# Altium project Version 2.PrjPcb
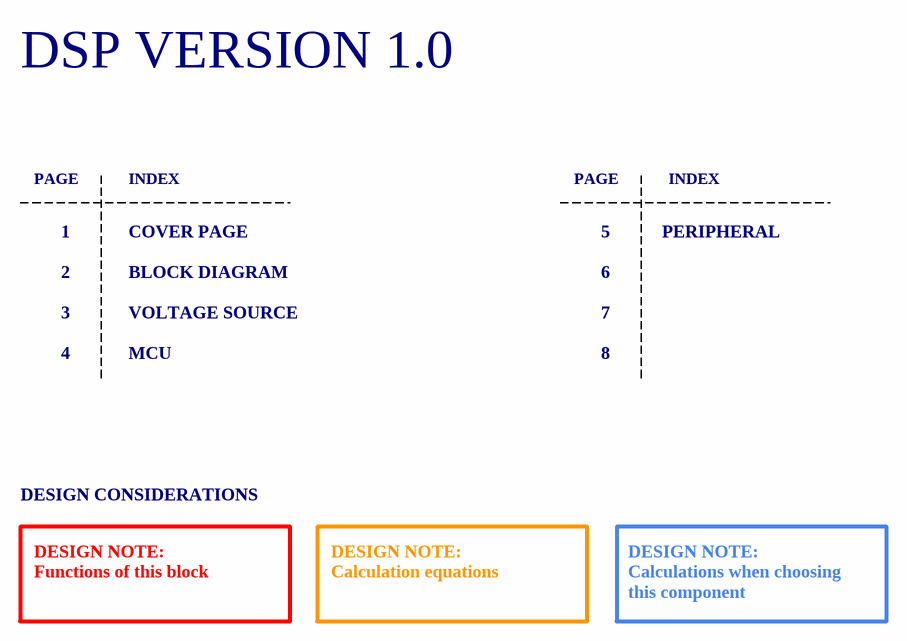
[diagram p0: Cover Page.SchDoc]
5 sheets, 113 parts. Net scope: global (net labels, ports and power ports of the same name join across sheets).
Sheets:
  Cover Page.SchDoc
  Block Diagram.SchDoc
  Voltage Source.SchDoc
  MCU.SchDoc
  PERIPHERAL.SchDoc

## Sheet Cover Page.SchDoc: Cover Page
size A4; Author: DODANHLUONG; Revision: 1.0; SheetNumber: 1; SheetTotal: 6; ProjectTitle: DSP_VERSION_1.0

### Notes on the sheet
- DSP VERSION 1.0
- PAGE
- INDEX
- 1
- 2
- COVER PAGE
- BLOCK DIAGRAM
- 5
- 6
- PERIPHERAL
- 3
- 4
- VOLTAGE SOURCE
- MCU
- 7
- 8
- DESIGN CONSIDERATIONS
- DESIGN NOTE:
  Functions of this block
- DESIGN NOTE:
  Calculation equations
- DESIGN NOTE:
  Calculations when choosing this component
- Author:
- Title:
- Size:
- A4
- Project:
- Approved:
- Revision:
- Modified Date:
- CONFIDENTIAL
- Date:
- SW Version:

## Sheet Block Diagram.SchDoc: Block Diagram
size A4; Author: DODANHLUONG; Revision: 1.0; SheetNumber: 2; SheetTotal: 6; ProjectTitle: DSP_VERSION_1.0

### Notes on the sheet
- Author:
- Title:
- Size:
- A4
- Project:
- Approved:
- Revision:
- Modified Date:
- CONFIDENTIAL
- Date:
- SW Version:

## Sheet Voltage Source.SchDoc: Voltage Source
size A4; Author: DODANHLUONG; Revision: 1.0; SheetNumber: 6; SheetTotal: 5; ProjectTitle: DSP_VERSION_1.0
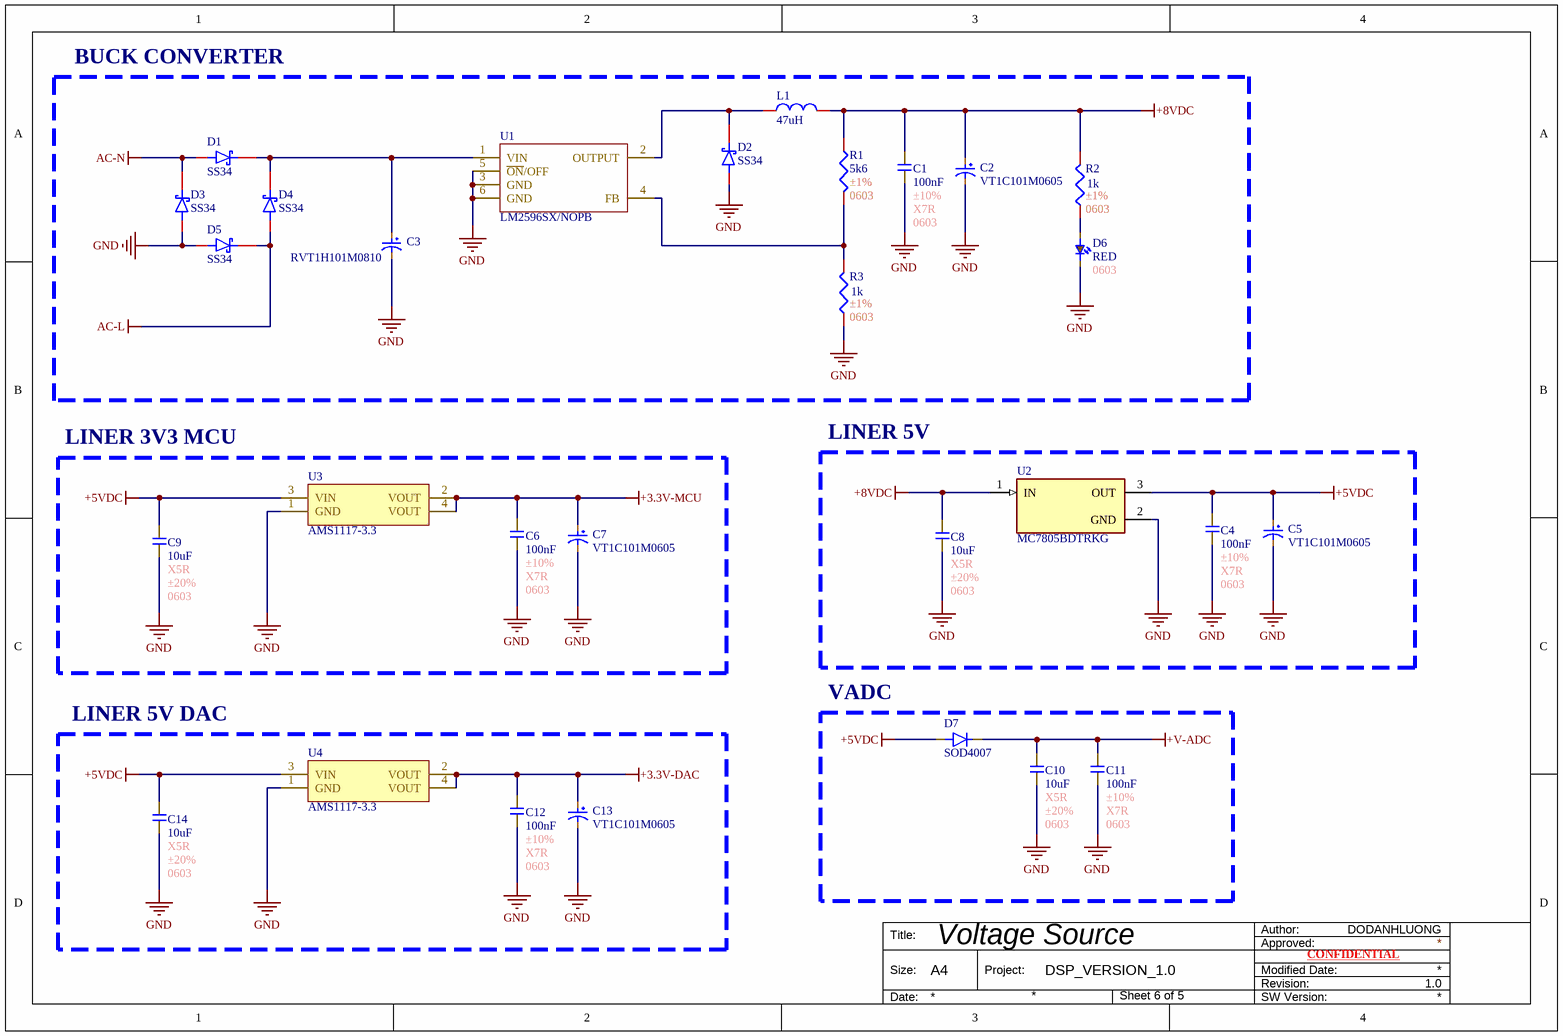
[diagram p1: Voltage Source.SchDoc]

### Parts
C1  100nF  Tolerance: ±10%  Temperature Coefficient: X7R  Package: 0603  [C0603]
C2  VT1C101M0605  [C_100uF_16V_Aluminum]
C3  RVT1H101M0810  [C_100uF_Aluminum]
C4  100nF  Tolerance: ±10%  Temperature Coefficient: X7R  Package: 0603  [C0603]
C5  VT1C101M0605  [C_100uF_16V_Aluminum]
C6  100nF  Tolerance: ±10%  Temperature Coefficient: X7R  Package: 0603  [C0603]
C7  VT1C101M0605  [C_100uF_16V_Aluminum]
C8  10uF  Temperature Coefficient: X5R  Tolerance: ±20%  Package: 0603  [C0603]
C9  10uF  Temperature Coefficient: X5R  Tolerance: ±20%  Package: 0603  [C0603]
C10  10uF  Temperature Coefficient: X5R  Tolerance: ±20%  Package: 0603  [C0603]
C11  100nF  Tolerance: ±10%  Temperature Coefficient: X7R  Package: 0603  [C0603]
C12  100nF  Tolerance: ±10%  Temperature Coefficient: X7R  Package: 0603  [C0603]
C13  VT1C101M0605  [C_100uF_16V_Aluminum]
C14  10uF  Temperature Coefficient: X5R  Tolerance: ±20%  Package: 0603  [C0603]
D1  SS34  [SS34]
D2  SS34  [SS34]
D3  SS34  [SS34]
D4  SS34  [SS34]
D5  SS34  [SS34]
D6  RED  Package: 0603  [LED0603]
D7  SOD4007  [SOD4007]
L1  47uH  [CD43]
R1  5k6  Tolerance: ±1%  Package: 0603  [R0603]
R2  1k  Tolerance: ±1%  Package: 0603  [R0603]
R3  1k  Tolerance: ±1%  Package: 0603  [R0603]
U1  LM2596SX/NOPB  [LM2596SX-5.0/NOPB]
U2  MC7805BDTRKG  [7805]
U3  AMS1117-3.3  [AMS1117-3.3]
U4  AMS1117-3.3  [AMS1117-3.3]

### Blocks framed on the sheet
BUCK CONVERTER: C1-C3 D1-D6 L1 R1-R3 U1
LINER 3V3 MCU: C6 C7 C9 U3
LINER 5V: C4 C5 C8 U2
LINER 5V DAC: C12-C14 U4
VADC: C10 C11 D7

### Nets
+3.3V-DAC: C12.2 C13.1 U4.2(VOUT) U4.4(VOUT)
+3.3V-MCU: C6.2 C7.1 U3.2(VOUT) U3.4(VOUT)
+5VDC: C4.2 C5.1 C9.2 C14.2 D7.2(A) U2.3(OUT) U3.3(VIN) U4.3(VIN)
+8VDC: C1.2 C2.1 C8.2 L1.2 R1.1 R2.2 U2.1(IN)
+V-ADC: C10.2 C11.2 D7.1(C)
AC-L: D4.2 D5.1
AC-N: D1.2 D3.1
GND: C1.1 C2.2 C3.2 C4.1 C5.2 C6.1 C7.2 C8.1 C9.1 C10.1 C11.1 C12.1 C13.2 C14.1 D2.2 D3.2 D5.2 D6.1 R3.1 U1.3(GND) U1.5(~{ON}/OFF) U1.6(GND) U2.2(GND) U3.1(GND) U4.1(GND)
NetC3_1: C3.1 D1.1 D4.1 U1.1(VIN)
NetD2_1: D2.1 L1.1 U1.2(OUTPUT)
NetD6_2: D6.2 R2.1
NetR1_2: R1.2 R3.2 U1.4(FB)

### Notes on the sheet
- Author:
- Title:
- Size:
- A4
- Project:
- Approved:
- Revision:
- Modified Date:
- CONFIDENTIAL
- Date:
- SW Version:

### Library data of the parts
C1 C4 C6 C11 C12 = C0603_100nF_±10%_X7R: 50V 100nF X7R ±10% 0603 Multilayer Ceramic Capacitors MLCC - SMD/SMT ROHS; Manufacturer: YAGEO; Mfr. Part #: CC0603KRX7R9BB104; LCSC Part #: C14663; Capacitance: 100nF; Link: https://www.lcsc.com/product-detail/C14663.html?s_z=n_capital%25200603%2520100nf
C2 C5 C7 C13 = C_100uF_16V_aluminum: 100uF 16V ±20% 63mA@120Hz SMD,D6.3xL5.4mm Aluminum Electrolytic Capacitors RoHS; Manufacturer: ROQANG; Key Attributes: CAP ALUM 100uF ±20% 16V SMD; Mfr. Part #: VT1C101M0605; LCSC Part #: C90273; Package: SMD,D6.3xL5.4mm; Link: https://www.lcsc.com/product-detail/C90273.html?s_z=n_capital%2520100uf%2520aluminum
C3 = C_100uF_aluminum: 100uF 50V ±20% 146mA@120Hz SMD,D8xL10.2mm Aluminum Electrolytic Capacitors RoHS; Manufacturer: ROQANG; Key Attributes: CAP ALUM 100uF ±20% 50V SMD; Mfr. Part #: RVT1H101M0810; LCSC Part #: C72480; Package: SMD,D8xL10.2mm; Link: https://www.lcsc.com/product-detail/C72480.html?s_z=n_capital%2520100uf%2520aluminum
C8-C10 C14 = C0603_10uF_±10%_X7R: 25V 10uF X5R ±20% 0603 Multilayer Ceramic Capacitors MLCC - SMD/SMT ROHS; Manufacturer: YAGEO; Mfr. Part #: CC0603MRX5R8BB106; LCSC Part #: C596327; Capacitance: 10uF; Link: https://www.lcsc.com/product-detail/C596327.html?s_z=n_capital%25200603%252010uF%2520yageo
D1-D5 = SS34: 40V Independent 3A 550mV@3A SMA(DO-214AC) Schottky Diodes ROHS; Manufacturer: MDD(Microdiode Semiconductor); Mfr. Part #: SS34; LCSC Part #: C8678; Package: SMA(DO-214AC); Voltage - DC Reverse(Vr): 40V; Current - Rectified: 3A; Link: https://www.lcsc.com/product-detail/C8678.html?s_z=n_SS34
D6 = D0603_RED: 25mcd~40mcd Water Clear -40℃~+85℃ 624nm Red 120° 60mW 0402 LED Indication - Discrete ROHS; Manufacturer: XINGLIGHT; Mfr. Part #: XL-1005UGC; Voltage - Forward(Vf): 3V; LCSC Part #: C965793; Power(Watts): 60mW; Link: https://www.lcsc.com/product-detail/C136765.html?s_z=n_LED%25200402%2520RED; Illumination Color: RED
D7 = SOD4007: 1A Independent 1kV 1.1V@1A SOD-123FL Diodes - General Purpose ROHS; Manufacturer: MDD(Microdiode Semiconductor); Mfr. Part #: SOD4007; Package: SOD-123FL; LCSC Part #: C18124; Link: https://www.lcsc.com/product-detail/C18124.html?s_z=n_SOD4007; Voltage - DC Reverse(Vr): 1kV; Current - Rectified: 1A
L1 = CD4-10UH: 1.15A 10uH Unshielded Inductor ±20% SMD,4x4.5mm Power Inductors ROHS; Manufacturer: ZE; Mfr. Part #: CD43-100M; Key Attributes: FIXED IND 10uH 1.15A 182mΩ SMD,4x4.5mm; DC Resistance(DCR): 182mΩ; LCSC Part #: C18734467; Package: SMD,4x4.5mm; Link: https://www.lcsc.com/product-detail/C18734467.html?s_z=n_CD43%252010uH; Tolerance: ±20%; Current Rating: 1.15A; Inductance: 10uH
R1-R3 = R0603_4k7Ω_±1%: 62.5mW Thick Film Resistor 50V ±1% ±200ppm/℃ 10Ω 0402 Chip Resistor - Surface Mount ROHS; Manufacturer: YAGEO; Mfr. Part #: RC0402FR-0710RL; Resistance: 4k7Ω; LCSC Part #: C138066; Link: https://www.lcsc.com/product-detail/C138066.html?s_z=n_resistor%25200402%252010R
U1 = LM2596SX/NOPB: 150kHz Buck Fixed 1 TO-263-5 Voltage Regulators - DC DC Switching Regulators RoHS; Manufacturer: TI; Key Attributes: LM2596 SIMPLE SWITCHER 3A Step-Down Voltage Regulator; Mfr. Part #: LM2596SX/NOPB; LCSC Part #: C10002; Package: TO-263-5; Link: https://www.lcsc.com/product-detail/C10002.html?s_z=n_lm2596
U2 = 7805: 68dB@(120Hz) 1A Fixed 5V Positive 24V TO-252-2(DPAK) Voltage Regulators - Linear, Low Drop Out (LDO) Regulators ROHS; Manufacturer: onsemi; Mfr. Part #: MC7805BDTRKG; LCSC Part #: C110908; Package: TO-252-2(DPAK); Output Current: 1A; Output Voltage: 5V; Voltage - Supply: 24V; Link: https://www.lcsc.com/product-detail/C110908.html?s_z=n_7805
U3 U4 = AMS1117-3.3: 72dB@(120Hz) 1A Fixed 3.3V Positive 16V SOT-223 Voltage Regulators - Linear, Low Drop Out (LDO) Regulators ROHS; Manufacturer: Advanced Monolithic Systems; LCSC Part #: C6186; Link: https://www.lcsc.com/product-detail/C6186.html?s_z=n_ams1117-3.3; Output Current: 1A; Package: SOT-223; Mfr. Part #: AMS1117-3.3

## Sheet MCU.SchDoc: MCU
size A4; Author: DODANHLUONG; Revision: 1.0; SheetNumber: 4; SheetTotal: 6; ProjectTitle: KIT ARDUINO VERSION 1.0
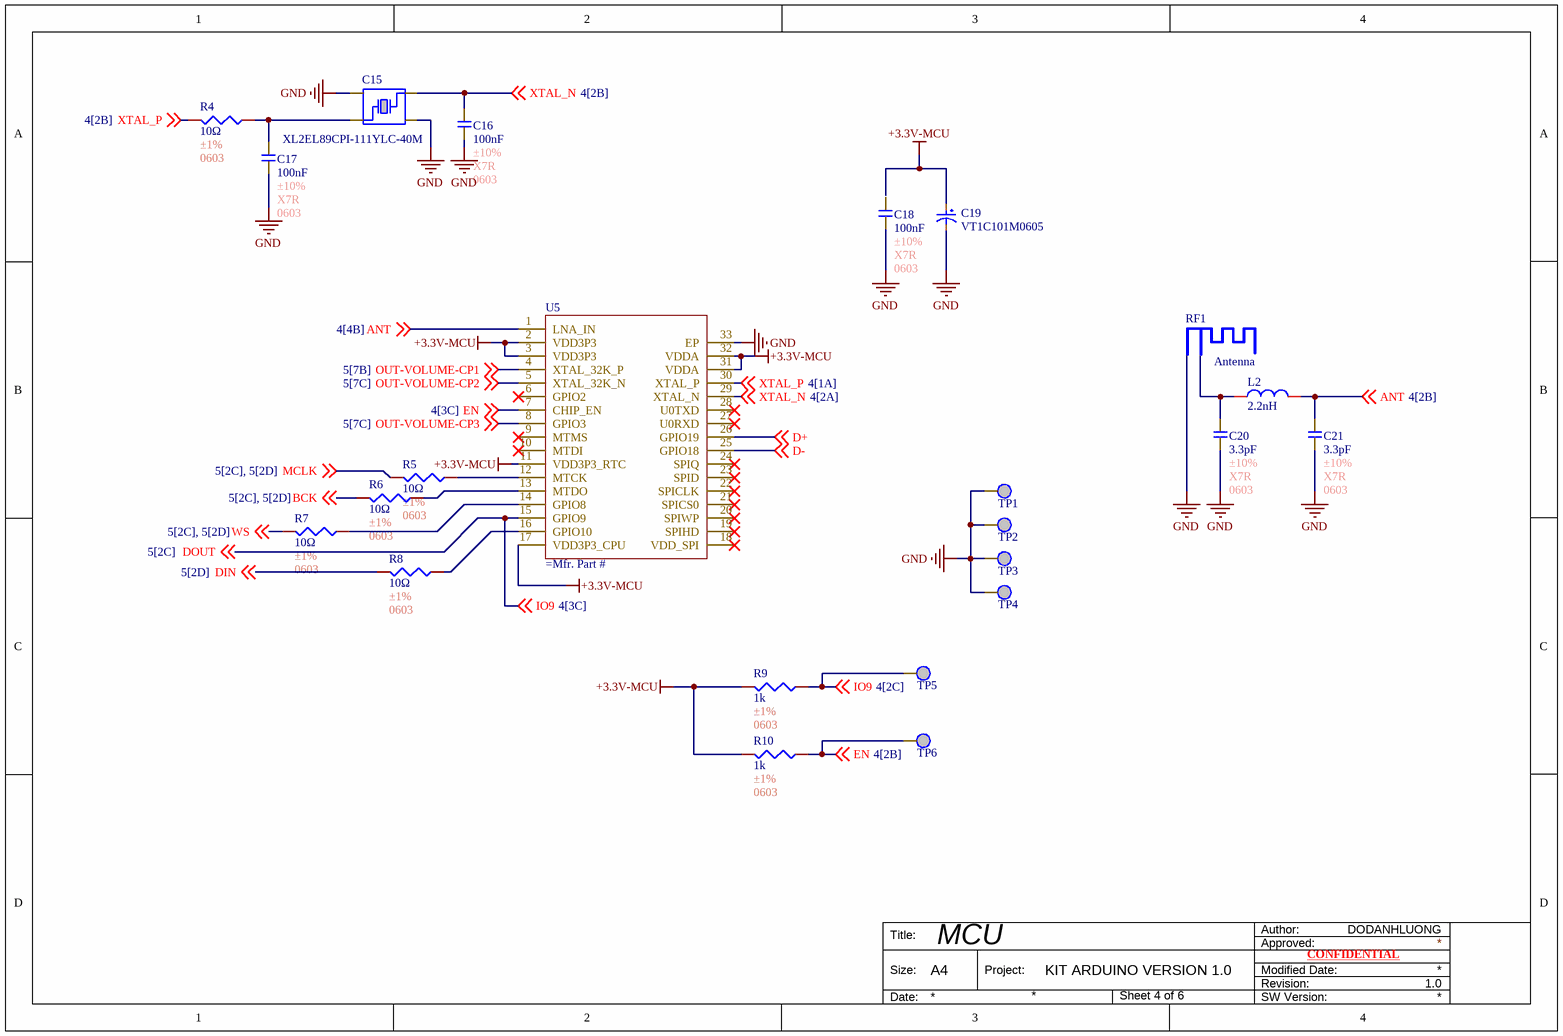
[diagram p2: MCU.SchDoc]

### Parts
C15  XL2EL89CPI-111YLC-40M  [XL2EL89CPI-111YLC-40M]
C16  100nF  Tolerance: ±10%  Temperature Coefficient: X7R  Package: 0603  [C0603]
C17  100nF  Tolerance: ±10%  Temperature Coefficient: X7R  Package: 0603  [C0603]
C18  100nF  Tolerance: ±10%  Temperature Coefficient: X7R  Package: 0603  [C0603]
C19  VT1C101M0605  [C_100uF_16V_Aluminum]
C20  3.3pF  Tolerance: ±10%  Temperature Coefficient: X7R  Package: 0603  [C0603]
C21  3.3pF  Tolerance: ±10%  Temperature Coefficient: X7R  Package: 0603  [C0603]
L2  2.2nH  [CD43]
R4  10Ω  Tolerance: ±1%  Package: 0603  [R0603]
R5  10Ω  Tolerance: ±1%  Package: 0603  [R0603]
R6  10Ω  Tolerance: ±1%  Package: 0603  [R0603]
R7  10Ω  Tolerance: ±1%  Package: 0603  [R0603]
R8  10Ω  Tolerance: ±1%  Package: 0603  [R0603]
R9  1k  Tolerance: ±1%  Package: 0603  [R0603]
R10  1k  Tolerance: ±1%  Package: 0603  [R0603]
RF1  Antenna  [2.4GHZ-50OHMS_v1.1]
TP1  TP  [TP]  (value not drawn)
TP2  TP  [TP]  (value not drawn)
TP3  TP  [TP]  (value not drawn)
TP4  TP  [TP]  (value not drawn)
TP5  TP  [TP]  (value not drawn)
TP6  TP  [TP]  (value not drawn)
U5  (no value)  [ESP32-C3]

### Nets
+3.3V-MCU: C19.1 R9.2 R10.2 U5.2(VDD3P3) U5.3(VDD3P3) U5.11(VDD3P3_RTC) U5.17(VDD3P3_CPU) U5.31(VDDA) U5.32(VDDA)
GND: C15.2 C15.4 C16.1 C17.1 C18.1 C19.2 C20.1 C21.1 RF1.2 TP1.1 TP2.1 TP3.1 TP4.1 U5.33(EP)
ANT: C21.2 L2.2 U5.1(LNA_IN) ; off-sheet ANT
BCK: R6.2 ; off-sheet BCK
D+: U5.26(GPIO19) ; off-sheet D+
D-: U5.25(GPIO18) ; off-sheet D-
DIN: R8.2 ; off-sheet DIN
DOUT: R9.1 TP5.1 U5.15(GPIO9) ; off-sheet DOUT, off-sheet IO9  [also labelled IO9]
EN: R10.1 TP6.1 U5.7(CHIP_EN) ; off-sheet EN
MCLK: R5.2 ; off-sheet MCLK
OUT-VOLUME-CP1: U5.4(XTAL_32K_P) ; off-sheet OUT-VOLUME-CP1
OUT-VOLUME-CP2: U5.5(XTAL_32K_N) ; off-sheet OUT-VOLUME-CP2
OUT-VOLUME-CP3: U5.8(GPIO3) ; off-sheet OUT-VOLUME-CP3
WS: R7.2 ; off-sheet WS
XTAL_N: C15.3 C16.2 U5.29(XTAL_N) ; off-sheet XTAL_N
XTAL_P: R4.2 U5.30(XTAL_P) ; off-sheet XTAL_P
NetC15_1: C15.1 C17.2 R4.1
NetC20_2: C20.2 L2.1 RF1.1
NetR5_1: R5.1 U5.12(MTCK)
NetR6_1: R6.1 U5.13(MTDO)
NetR7_1: R7.1 U5.14(GPIO8)
NetR8_1: R8.1 U5.16(GPIO10)

Not connected (* = marked no-connect by the designer): C18 2; U5 6(GPIO2)* 9(MTMS)* 10(MTDI)* 18(VDD_SPI)* 19(SPIHD)* 20(SPIWP)* 21(SPICS0)* 22(SPICLK)* 23(SPID)* 24(SPIQ)* 27(U0RXD)* 28(U0TXD)*

### Notes on the sheet
- Author:
- Title:
- Size:
- A4
- Project:
- Approved:
- Revision:
- Modified Date:
- CONFIDENTIAL
- Date:
- SW Version:

### Library data of the parts
C15 = XL2EL89CPI-111YLC-40M: Crystal Oscillator 15pF SMD3225-4P Crystals RoHS; Manufacturer: YXC Crystal Oscillators; Mfr. Part #: XL2EL89CPI-111YLC-40M; LCSC Part #: C5444549; Package: SMD3225-4P; Link: https://www.lcsc.com/product-detail/C5444549.html?s_z=n_oscillator; Key Attributes: Crystal Oscillator 15pF SMD3225-4P Crystals RoHS
C16-C18 C20 C21 = C0603_100nF_±10%_X7R: as C1 on sheet Voltage Source; LCSC Part #: C14663; Capacitance: 100nF; Link: https://www.lcsc.com/product-detail/C14663.html?s_z=n_capital%25200603%2520100nf
C19 = C_100uF_16V_aluminum: as C2 on sheet Voltage Source; Mfr. Part #: VT1C101M0605; LCSC Part #: C90273; Package: SMD,D6.3xL5.4mm; Link: https://www.lcsc.com/product-detail/C90273.html?s_z=n_capital%2520100uf%2520aluminum
L2 = CD4-10UH: as L1 on sheet Voltage Source; LCSC Part #: C18734467; Package: SMD,4x4.5mm; Link: https://www.lcsc.com/product-detail/C18734467.html?s_z=n_CD43%252010uH; Tolerance: ±20%; Current Rating: 1.15A; Inductance: 10uH
R4-R10 = R0603_10Ω_±1%: 62.5mW Thick Film Resistor 50V ±1% ±200ppm/℃ 10Ω 0402 Chip Resistor - Surface Mount ROHS; Manufacturer: YAGEO; Mfr. Part #: RC0402FR-0710RL; LCSC Part #: C138066; Resistance: 10Ω; Link: https://www.lcsc.com/product-detail/C138066.html?s_z=n_resistor%25200402%252010R
U5 = ESP32-C3: Others 160MHz QFN-32-EP(5x5) RF Transceiver Modules and Modems RoHS; Manufacturer: ESPRESSIF; LCSC Part #: C2838500; Package: QFN-32-EP(5x5); Link: https://www.lcsc.com/product-detail/C2838500.html?s_z=n_ESP32%2520C3

## Sheet PERIPHERAL.SchDoc: PERIPHERAL
size A3; Author: DODANHLUONG; Revision: 1.0; SheetNumber: 5; SheetTotal: 5; ProjectTitle: DSP_VERSION_1.0
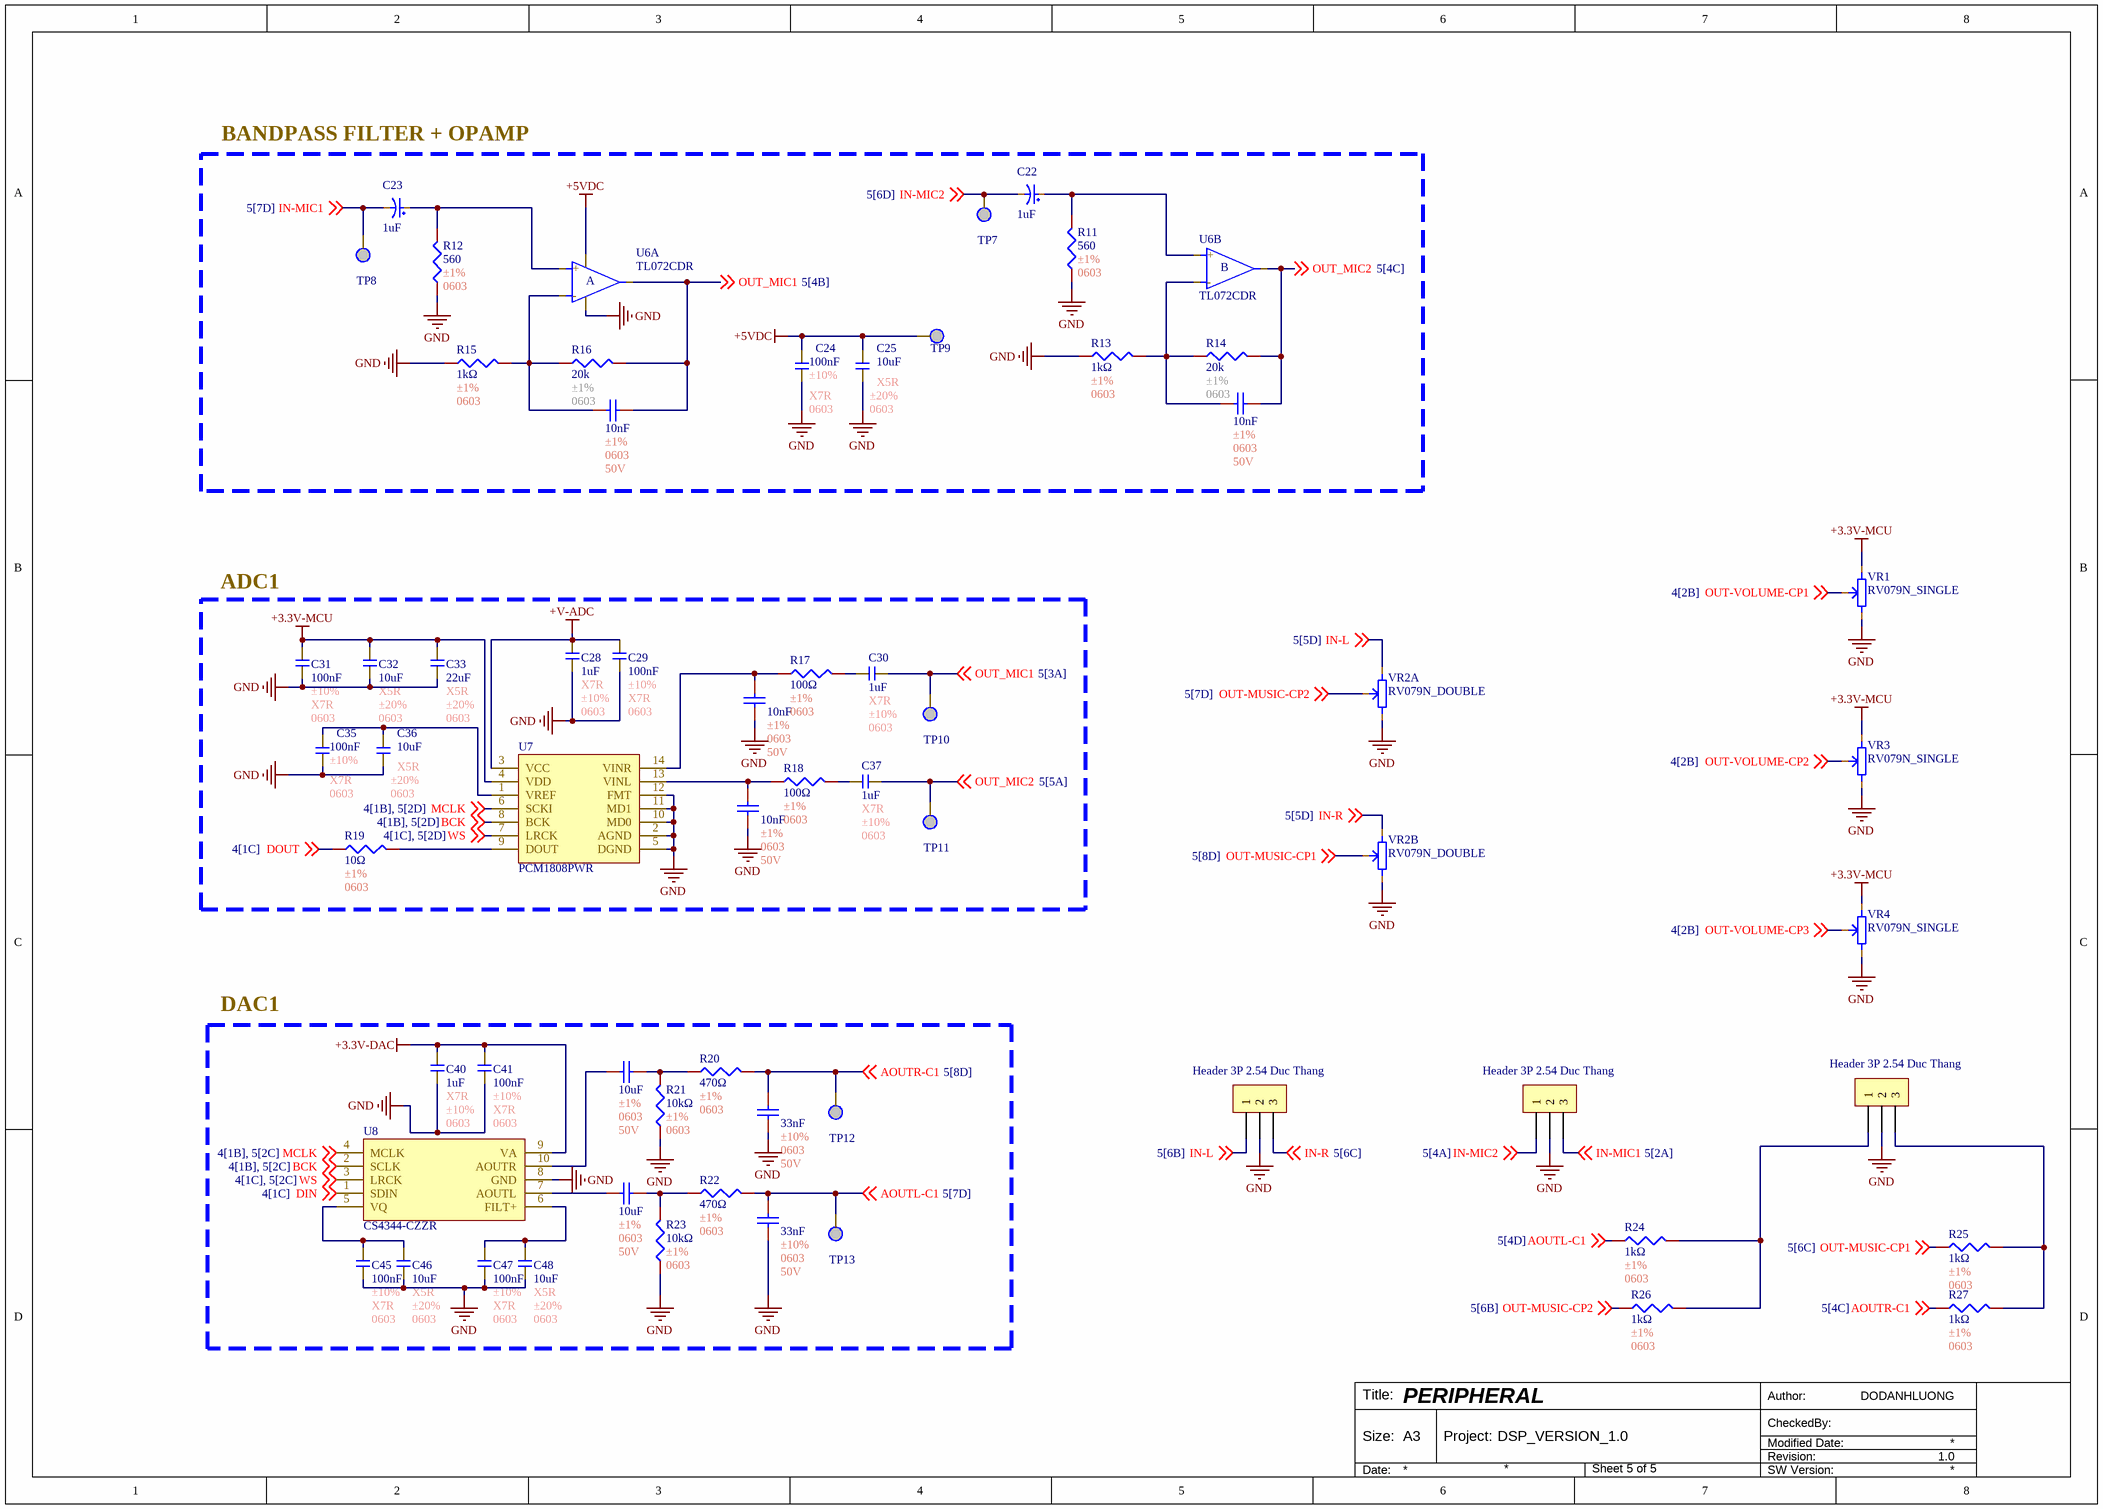
[diagram p3: PERIPHERAL.SchDoc]

### Parts
C22  1uF  [C_TH_5x11mm]
C23  1uF  [C_TH_5x11mm]
C24  100nF  Tolerance: ±10%  Temperature Coefficient: X7R  Package: 0603  [C0603]
C25  10uF  Temperature Coefficient: X5R  Tolerance: ±20%  Package: 0603  [C0603]
C26  10nF  Tolerance: ±1%  Package: 0603  Voltage Rating: 50V  [C0603]
C27  10nF  Tolerance: ±1%  Package: 0603  Voltage Rating: 50V  [C0603]
C28  1uF  Temperature Coefficient: X7R  Tolerance: ±10%  Package: 0603  [C0603]
C29  100nF  Tolerance: ±10%  Temperature Coefficient: X7R  Package: 0603  [C0603]
C30  1uF  Temperature Coefficient: X7R  Tolerance: ±10%  Package: 0603  [C0603]
C31  100nF  Tolerance: ±10%  Temperature Coefficient: X7R  Package: 0603  [C0603]
C32  10uF  Temperature Coefficient: X5R  Tolerance: ±20%  Package: 0603  [C0603]
C33  22uF  Temperature Coefficient: X5R  Tolerance: ±20%  Package: 0603  [C0603]
C34  10nF  Tolerance: ±1%  Package: 0603  Voltage Rating: 50V  [C0603]
C35  100nF  Tolerance: ±10%  Temperature Coefficient: X7R  Package: 0603  [C0603]
C36  10uF  Temperature Coefficient: X5R  Tolerance: ±20%  Package: 0603  [C0603]
C37  1uF  Temperature Coefficient: X7R  Tolerance: ±10%  Package: 0603  [C0603]
C38  10nF  Tolerance: ±1%  Package: 0603  Voltage Rating: 50V  [C0603]
C39  10uF  Tolerance: ±1%  Package: 0603  Voltage Rating: 50V  [C0603]
C40  1uF  Temperature Coefficient: X7R  Tolerance: ±10%  Package: 0603  [C0603]
C41  100nF  Tolerance: ±10%  Temperature Coefficient: X7R  Package: 0603  [C0603]
C42  33nF  Tolerance: ±10%  Package: 0603  Voltage Rating: 50V  [C0603]
C43  10uF  Tolerance: ±1%  Package: 0603  Voltage Rating: 50V  [C0603]
C44  33nF  Tolerance: ±10%  Package: 0603  Voltage Rating: 50V  [C0603]
C45  100nF  Tolerance: ±10%  Temperature Coefficient: X7R  Package: 0603  [C0603]
C46  10uF  Temperature Coefficient: X5R  Tolerance: ±20%  Package: 0603  [C0603]
C47  100nF  Tolerance: ±10%  Temperature Coefficient: X7R  Package: 0603  [C0603]
C48  10uF  Temperature Coefficient: X5R  Tolerance: ±20%  Package: 0603  [C0603]
H1  Header 3P 2.54 Duc Thang  [XH2.54M-3]
H2  Header 3P 2.54 Duc Thang  [XH2.54M-3]
H3  Header 3P 2.54 Duc Thang  [XH2.54M-3]
R11  560  Tolerance: ±1%  Package: 0603  [R0603]
R12  560  Tolerance: ±1%  Package: 0603  [R0603]
R13  1kΩ  Tolerance: ±1%  Package: 0603  [R0603]
R14  20k  Tolerance: ±1%  Package: 0603  [R0603]
R15  1kΩ  Tolerance: ±1%  Package: 0603  [R0603]
R16  20k  Tolerance: ±1%  Package: 0603  [R0603]
R17  100Ω  Tolerance: ±1%  Package: 0603  [R0603]
R18  100Ω  Tolerance: ±1%  Package: 0603  [R0603]
R19  10Ω  Tolerance: ±1%  Package: 0603  [R0603]
R20  470Ω  Tolerance: ±1%  Package: 0603  [R0603]
R21  10kΩ  Tolerance: ±1%  Package: 0603  [R0603]
R22  470Ω  Tolerance: ±1%  Package: 0603  [R0603]
R23  10kΩ  Tolerance: ±1%  Package: 0603  [R0603]
R24  1kΩ  Tolerance: ±1%  Package: 0603  [R0603]
R25  1kΩ  Tolerance: ±1%  Package: 0603  [R0603]
R26  1kΩ  Tolerance: ±1%  Package: 0603  [R0603]
R27  1kΩ  Tolerance: ±1%  Package: 0603  [R0603]
TP7  TP  [TP]  (value not drawn)
TP8  TP  [TP]  (value not drawn)
TP9  TP  [TP]  (value not drawn)
TP10  TP  [TP]  (value not drawn)
TP11  TP  [TP]  (value not drawn)
TP12  TP  [TP]  (value not drawn)
TP13  TP  [TP]  (value not drawn)
U6  TL072CDR  [TL072CDR]  (parts A,B of 2)
U7  PCM1808PWR  [PCM1808PWR]
U8  CS4344-CZZR  [CS4344-CZZR]
VR1  RV079N_SINGLE  [RK079N_SINGLE]
VR2  RV079N_DOUBLE  [RK079N_DOUBLE]  (parts A,B of 2)
VR3  RV079N_SINGLE  [RK079N_SINGLE]
VR4  RV079N_SINGLE  [RK079N_SINGLE]

### Blocks framed on the sheet
BANDPASS FILTER + OPAMP: C22-C27 R11-R16 TP7-TP9 U6
ADC1: C28-C38 R17-R19 TP10 TP11 U7
DAC1: C39-C48 R20-R23 TP12 TP13 U8

### Nets
+3.3V-DAC: C40.2 C41.2 U8.9(VA)
+3.3V-MCU: C31.2 C32.2 C33.2 U7.4(VDD) VR1.3 VR3.3 VR4.3
+5VDC: C24.2 C25.2 TP9.1 U6.8
+V-ADC: C28.2 C29.2 U7.3(VCC)
GND: C24.1 C25.1 C28.1 C29.1 C31.1 C32.1 C33.1 C34.2 C35.1 C36.1 C38.2 C40.1 C41.1 C42.2 C44.2 C45.1 C46.1 C47.1 C48.1 H1.2 H2.2 H3.2 R11.1 R12.1 R13.1 R15.1 R21.1 R23.1 U6.4(GND) U7.2(AGND) U7.5(DGND) U7.10(MD0) U7.11(MD1) U7.12(FMT) U8.8(GND) VR1.1 VR2.1 VR2.4 VR3.1 VR4.1
AOUTL-C1: C44.1 R22.2 R24.1 TP13.1 ; off-sheet AOUTL-C1
AOUTR-C1: C42.1 R20.2 R27.1 TP12.1 ; off-sheet AOUTR-C1
BCK: U7.8(BCK) U8.2(SCLK) ; off-sheet BCK
DIN: U8.1(SDIN) ; off-sheet DIN
DOUT: R19.1 ; off-sheet DOUT
IN-L: H2.1 VR2.3 ; off-sheet IN-L
IN-MIC1: C23.2 H3.3 TP8.1 ; off-sheet IN-MIC1
IN-MIC2: C22.2 H3.1 TP7.1 ; off-sheet IN-MIC2
IN-R: H2.3 VR2.6 ; off-sheet IN-R
MCLK: U7.6(SCKI) U8.4(MCLK) ; off-sheet MCLK
OUT-MUSIC-CP1: R25.1 VR2.5 ; off-sheet OUT-MUSIC-CP1
OUT-MUSIC-CP2: R26.1 VR2.2 ; off-sheet OUT-MUSIC-CP2
OUT-VOLUME-CP1: VR1.2 ; off-sheet OUT-VOLUME-CP1
OUT-VOLUME-CP2: VR3.2 ; off-sheet OUT-VOLUME-CP2
OUT-VOLUME-CP3: VR4.2 ; off-sheet OUT-VOLUME-CP3
OUT_MIC1: C27.2 C30.1 R16.2 TP10.1 U6.1(out) ; off-sheet OUT_MIC1
OUT_MIC2: C26.2 C37.1 R14.2 TP11.1 U6.7(out) ; off-sheet OUT_MIC2
WS: U7.7(LRCK) U8.3(LRCK) ; off-sheet WS
NetC22_1: C22.1 R11.2 U6.5(+)
NetC23_1: C23.1 R12.2 U6.3(+)
NetC26_1: C26.1 R13.2 R14.1 U6.6(-)
NetC27_1: C27.1 R15.2 R16.1 U6.2(-)
NetC30_2: C30.2 R17.2
NetC34_1: C34.1 R17.1 U7.14(VINR)
NetC35_2: C35.2 C36.2 U7.1(VREF)
NetC37_2: C37.2 R18.2
NetC38_1: C38.1 R18.1 U7.13(VINL)
NetC39_1: C39.1 R20.1 R21.2
NetC39_2: C39.2 U8.10(AOUTR)
NetC43_1: C43.1 R22.1 R23.2
NetC43_2: C43.2 U8.7(AOUTL)
NetC45_2: C45.2 C46.2 U8.5(VQ)
NetC47_2: C47.2 C48.2 U8.6(FILT+)
NetH1_1: H1.1 R24.2 R26.2
NetH1_3: H1.3 R25.2 R27.2
NetR19_2: R19.2 U7.9(DOUT)

### Notes on the sheet
- Author:
- Title:
- Size:
- A3
- Project:
- Revision:
- Modified Date:
- CheckedBy:
- Date:
- SW Version:
- (in symbol TL072CDR, part A) A
- (in symbol TL072CDR, part B) B

### Library data of the parts
C22 C23 = C_10uF_5x11TH: 10uF 50V ±20% Through Hole,D5xL11mm Aluminum Electrolytic Capacitors - Leaded ROHS; Manufacturer: Rubycon; Mfr. Part #: 50YXF10MEFC5X11; Key Attributes: CAP ALUM 10uF ±20% 50V TH; Pin Spacing: 2mm; LCSC Part #: C88726; Package: Through Hole,D5xL11mm; Tolerance: ±20%; Voltage Rating: 50V; Capacitance: 10uF; Link: https://www.lcsc.com/product-detail/C88726.html?s_z=n_electrolytic%252010uF
C24 C29 C31 C35 C41 C45 C47 = C0603_100nF_±10%_X7R: as C1 on sheet Voltage Source; LCSC Part #: C14663; Capacitance: 100nF; Link: https://www.lcsc.com/product-detail/C14663.html?s_z=n_capital%25200603%2520100nf
C25 C32 C36 C46 C48 = C0603_10uF_±10%_X7R: as C8 on sheet Voltage Source; LCSC Part #: C596327; Capacitance: 10uF; Link: https://www.lcsc.com/product-detail/C596327.html?s_z=n_capital%25200603%252010uF%2520yageo
C26 C27 C34 C38 = C0603_10nF_±1%: 50V 10pF NP0 ±1% 0402 Multilayer Ceramic Capacitors MLCC - SMD/SMT ROHS; Manufacturer: YAGEO; Mfr. Part #: CC0402FRNPO9BN100; LCSC Part #: C513681; Link: https://www.lcsc.com/product-detail/C513681.html?s_z=n_capital%2520yageo%252010pF%25200402; Capacitance: 10nF
C28 C30 C37 C40 = C0603_1uF_±10%_X7R: 50V 1uF X7R ±10% 0603 Multilayer Ceramic Capacitors MLCC - SMD/SMT ROHS; Manufacturer: YAGEO; Mfr. Part #: CC0603KRX7R9BB105; LCSC Part #: C559769; Capacitance: 1uF; Link: https://www.lcsc.com/product-detail/C559769.html?s_z=n_capital%25200603%25201uF%2520yageo
C33 = C0603_22uF_±20%_X5R: 6.3V 22uF X5R ±20% 0603 Multilayer Ceramic Capacitors MLCC - SMD/SMT ROHS; Manufacturer: YAGEO; Mfr. Part #: CC0603MRX5R5BB226; LCSC Part #: C109448; ComponentLink1Description: New link; ComponentLink1URL: *; Capacitance: 22uF; Link: https://www.lcsc.com/product-detail/C109448.html?s_z=n_capital%25200603%252022uf%2520yageo
C39 C43 = C0603_10uF_±1%: 50V 10pF NP0 ±1% 0402 Multilayer Ceramic Capacitors MLCC - SMD/SMT ROHS; Manufacturer: YAGEO; Mfr. Part #: CC0402FRNPO9BN100; LCSC Part #: C513681; Link: https://www.lcsc.com/product-detail/C513681.html?s_z=n_capital%2520yageo%252010pF%25200402; Capacitance: 10uF
C42 C44 = C0603_33nF_±10%: 100mW Thick Film Resistor 75V ±100ppm/℃ ±1% 470Ω 0603 Chip Resistor - Surface Mount ROHS; Manufacturer: YAGEO; Mfr. Part #: CC0603KRX7R9BB333; Temperature Coefficient: X7R; LCSC Part #: C106856; Link: https://www.lcsc.com/product-detail/C106856.html?s_z=n_capital%2520yageo%25200603%252033nF; Capacitance: 33nF
H1-H3 = Header 3P 2.54 Duc Thang: Cắm; Ten_Linh_Kien: Header 3P XH2.54-3P Đực Thẳng; Don_Vi: Con; Ma_Hang: MH001292; Chung_Loai: Cắm
R11 R12 = R0603_10kΩ_±1%: 62.5mW Thick Film Resistor 50V ±1% ±200ppm/℃ 10Ω 0402 Chip Resistor - Surface Mount ROHS; Manufacturer: YAGEO; Mfr. Part #: RC0402FR-0710RL; Resistance: 10kΩ; LCSC Part #: C138066; Link: https://www.lcsc.com/product-detail/C138066.html?s_z=n_resistor%25200402%252010R
R13 R15 R24-R27 = R0603_1kΩ_±1%: 62.5mW Thick Film Resistor 50V ±1% ±200ppm/℃ 10Ω 0402 Chip Resistor - Surface Mount ROHS; Manufacturer: YAGEO; Mfr. Part #: RC0402FR-0710RL; LCSC Part #: C138066; Resistance: 1kΩ; Link: https://www.lcsc.com/product-detail/C138066.html?s_z=n_resistor%25200402%252010R
R14 R16 = R0603_5k1Ω_±1%: 100mW Thick Film Resistor 75V ±100ppm/℃ ±1% 5.1kΩ 0603 Chip Resistor - Surface Mount ROHS; Manufacturer: FOJAN; Mfr. Part #: FRC0603F5101TS; Key Attributes: RES 5.1kΩ ±1% 100mW 0603; Resistance: 5k1Ω; LCSC Part #: C2907044; Link: https://www.lcsc.com/product-detail/C2907044.html?s_z=n_5k1%25200603
R17 R18 = R0603_100Ω_±1%: 62.5mW Thick Film Resistor 50V ±1% ±200ppm/℃ 10Ω 0402 Chip Resistor - Surface Mount ROHS; Manufacturer: YAGEO; Mfr. Part #: RC0402FR-0710RL; LCSC Part #: C138066; Resistance: 100Ω; Link: https://www.lcsc.com/product-detail/C138066.html?s_z=n_resistor%25200402%252010R
R19 = R0603_10Ω_±1%: as R4 on sheet MCU; LCSC Part #: C138066; Resistance: 10Ω; Link: https://www.lcsc.com/product-detail/C138066.html?s_z=n_resistor%25200402%252010R
R20 R22 = R0603_470Ω_±1%_1: 62.5mW Thick Film Resistor 50V ±1% ±200ppm/℃ 10Ω 0402 Chip Resistor - Surface Mount ROHS; Manufacturer: YAGEO; Mfr. Part #: RC0603FR-07470RL; Key Attributes: RES 470Ω ±1% 100mW 0603; LCSC Part #: C114669; Resistance: 470Ω; Link: https://www.lcsc.com/product-detail/C114669.html?s_z=n_resistor%2520470%25CE%25A9%25200603%2520yageo
R21 R23 = R0603_10kΩ_±1%: 62.5mW Thick Film Resistor 50V ±1% ±200ppm/℃ 10Ω 0402 Chip Resistor - Surface Mount ROHS; Manufacturer: YAGEO; Mfr. Part #: RC0402FR-0710RL; LCSC Part #: C138066; Resistance: 10kΩ; Link: https://www.lcsc.com/product-detail/C138066.html?s_z=n_resistor%25200402%252010R
U6 = TL072CDR: 3mV 65pA 3MHz 13V/us 2 SOIC-8 FET Input Amplifiers ROHS; Manufacturer: TI; Noise density(eN): 18nV/√Hz@1kHz; Dual Supply: -15V~15V; Number of Channels: 2; LCSC Part #: C67473; Package: SOIC-8; Gain Bandwidth Product: 3MHz; Link: https://www.lcsc.com/product-detail/C67473.html?s_z=n_TL072CDR; Mfr. Part #: TL072CDR
U7 = PCM1808PWR: 4.5V~5.5V 24 I2S TSSOP-14 ADCs/DACs - Special Purpose ROHS; Manufacturer: TI; Key Attributes: Single-ended analog input 24-bit 96kHz stereo A/D converter; Number of Channels: 2; Mfr. Part #: PCM1808PWR; LCSC Part #: C55513; Package: TSSOP-14; Voltage - Supply: 4.5V~5.5V; Interface: I2S; Link: https://www.lcsc.com/product-detail/C55513.html?s_z=n_pcm1808
U8 = CS4344-CZZR: 250ms I2S 3.3V~5V 24 TSSOP-10-3mm Digital to Analog Converters (DAC) ROHS; Manufacturer: Cirrus Logic; Key Attributes: 10-Pin, 24-Bit, 192 kHz Stereo D/A Converter; Number of Channels: 2; Mfr. Part #: CS4344-CZZR; LCSC Part #: C8952; Package: TSSOP-10-3mm; Link: https://www.lcsc.com/product-detail/C8952.html?s_z=n_cs4344; Voltage - Supply: 3.3V~5V; Interface: I2S

## Nets that join several sheets
+3.3V-DAC: Voltage Source (C12.2 C13.1 U4.2 U4.4), PERIPHERAL (C40.2 C41.2 U8.9)
+3.3V-MCU: Voltage Source (C6.2 C7.1 U3.2 U3.4), MCU (9 pins), PERIPHERAL (7 pins)
+5VDC: Voltage Source (8 pins), PERIPHERAL (C24.2 C25.2 TP9.1 U6.8)
+V-ADC: Voltage Source (C10.2 C11.2 D7.1), PERIPHERAL (C28.2 C29.2 U7.3)
GND: Voltage Source (25 pins), MCU (14 pins), PERIPHERAL (40 pins)
BCK: MCU (R6.2), PERIPHERAL (U7.8 U8.2)
DIN: MCU (R8.2), PERIPHERAL (U8.1)
DOUT: MCU (R9.1 TP5.1 U5.15), PERIPHERAL (R19.1)
MCLK: MCU (R5.2), PERIPHERAL (U7.6 U8.4)
OUT-VOLUME-CP1: MCU (U5.4), PERIPHERAL (VR1.2)
OUT-VOLUME-CP2: MCU (U5.5), PERIPHERAL (VR3.2)
OUT-VOLUME-CP3: MCU (U5.8), PERIPHERAL (VR4.2)
WS: MCU (R7.2), PERIPHERAL (U7.7 U8.3)